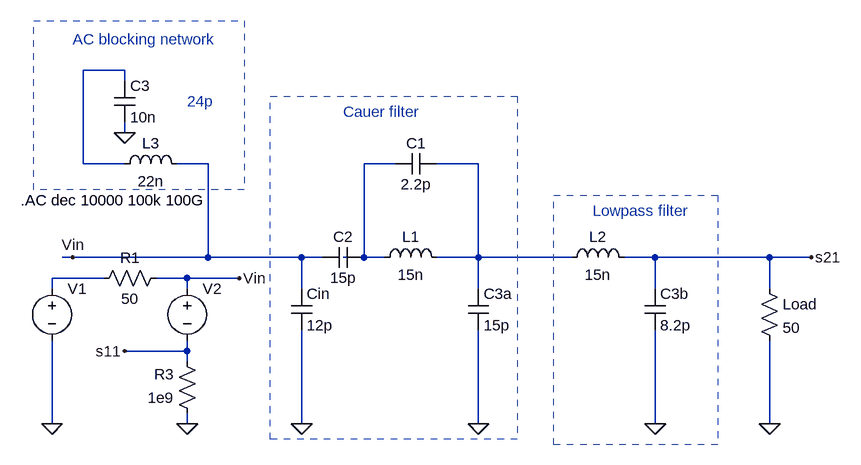
[diagram p0: schematic project_front_end_436.5_with_V+_version4.asc]
project_front_end_436.5_with_V+_version4.asc, the LTspice schematic file:
Version 4
SHEET 1 2444 680
WIRE -416 -80 -480 -80
WIRE -416 -64 -416 -80
WIRE -416 16 -416 0
WIRE -480 64 -480 -80
WIRE -416 64 -480 64
WIRE -288 64 -336 64
WIRE 0 64 -48 64
WIRE 128 64 64 64
WIRE -496 208 -512 208
WIRE -288 208 -288 64
WIRE -288 208 -496 208
WIRE -144 208 -288 208
WIRE -112 208 -144 208
WIRE -48 208 -48 64
WIRE -48 208 -80 208
WIRE -16 208 -48 208
WIRE 128 208 128 64
WIRE 128 208 64 208
WIRE 272 208 128 208
WIRE 400 208 352 208
WIRE 576 208 400 208
WIRE 640 208 576 208
WIRE -448 240 -528 240
WIRE -320 240 -368 240
WIRE -240 240 -320 240
WIRE -528 256 -528 240
WIRE -320 256 -320 240
WIRE -144 256 -144 208
WIRE 128 256 128 208
WIRE 400 256 400 208
WIRE 576 256 576 208
WIRE -320 352 -320 336
WIRE -320 352 -416 352
WIRE -320 368 -320 352
WIRE -528 464 -528 336
WIRE -320 464 -320 448
WIRE -144 464 -144 320
WIRE 128 464 128 320
WIRE 400 464 400 320
WIRE 576 464 576 336
FLAG 128 464 0
FLAG 576 464 0
FLAG -528 464 0
FLAG 400 464 0
FLAG -144 464 0
FLAG -240 240 Vin
FLAG -496 208 Vin
FLAG -416 16 0
FLAG -320 464 0
FLAG -416 352 s11
FLAG 640 208 s21
SYMBOL cap 112 256 R0
SYMATTR InstName C3a
SYMATTR Value 15p
SYMBOL cap 0 80 R270
WINDOW 0 32 32 VTop 2
WINDOW 3 0 32 VBottom 2
SYMATTR InstName C1
SYMATTR Value 2.2p
SYMBOL res 560 240 R0
SYMATTR InstName Load
SYMATTR Value 50
SYMBOL res -304 464 R180
WINDOW 0 36 76 Left 2
WINDOW 3 36 40 Left 2
SYMATTR InstName R3
SYMATTR Value 1e9
SYMBOL ind -32 224 R270
WINDOW 0 32 56 VTop 2
WINDOW 3 5 56 VBottom 2
SYMATTR InstName L1
SYMATTR Value 15n
SYMBOL cap 384 256 R0
SYMATTR InstName C3b
SYMATTR Value 8.2p
SYMBOL cap -160 256 R0
SYMATTR InstName Cin
SYMATTR Value 12p
SYMBOL ind 256 224 R270
WINDOW 0 32 56 VTop 2
WINDOW 3 5 56 VBottom 2
SYMATTR InstName L2
SYMATTR Value 15n
SYMBOL cap -432 -64 R0
SYMATTR InstName C3
SYMATTR Value 10n
SYMBOL ind -432 80 R270
WINDOW 0 32 56 VTop 2
WINDOW 3 5 56 VBottom 2
SYMATTR InstName L3
SYMATTR Value 22n
SYMBOL res -464 256 R270
WINDOW 0 32 56 VTop 2
WINDOW 3 0 56 VBottom 2
SYMATTR InstName R1
SYMATTR Value 50
SYMBOL voltage -528 240 R0
SYMATTR InstName V1
SYMATTR Value ""
SYMATTR Value2 AC 2
SYMBOL voltage -320 240 R0
SYMATTR InstName V2
SYMATTR Value ""
SYMATTR Value2 AC 1
SYMBOL cap -112 224 R270
WINDOW 0 32 32 VTop 2
WINDOW 3 0 32 VBottom 2
SYMATTR InstName C2
SYMATTR Value 15p
TEXT -576 120 Left 2 !.AC dec 10000 100k 100G
TEXT -320 -32 Left 2 ;24p
TEXT -80 -16 Left 2 ;Cauer filter
TEXT -496 -128 Left 2 ;AC blocking network
TEXT 304 136 Left 2 ;Lowpass filter
RECTANGLE Normal 244 112 496 496 2
RECTANGLE Normal -556 -156 -232 104 2
RECTANGLE Normal -192 -40 188 488 2

The netlist it stands for:
* project_front_end_436.5_with_V+_version4.asc
C3a N003 0 15p
C1 N002 N003 2.2p
R§Load s21 0 50
R3 0 s11 1e9
L1 N002 N003 15n
C3b s21 0 8.2p
Cin Vin 0 12p
L2 N003 s21 15n
C3 N001 0 10n
L3 N001 Vin 22n
R1 N004 Vin 50
V1 N004 0 AC 2
V2 Vin s11 AC 1
C2 Vin N002 15p
.AC dec 10000 100k 100G
* 24p
* Cauer filter
* AC blocking network
* Lowpass filter
.backanno
.end